# Altium schematic sheet Sheet2.SchDoc
size A4
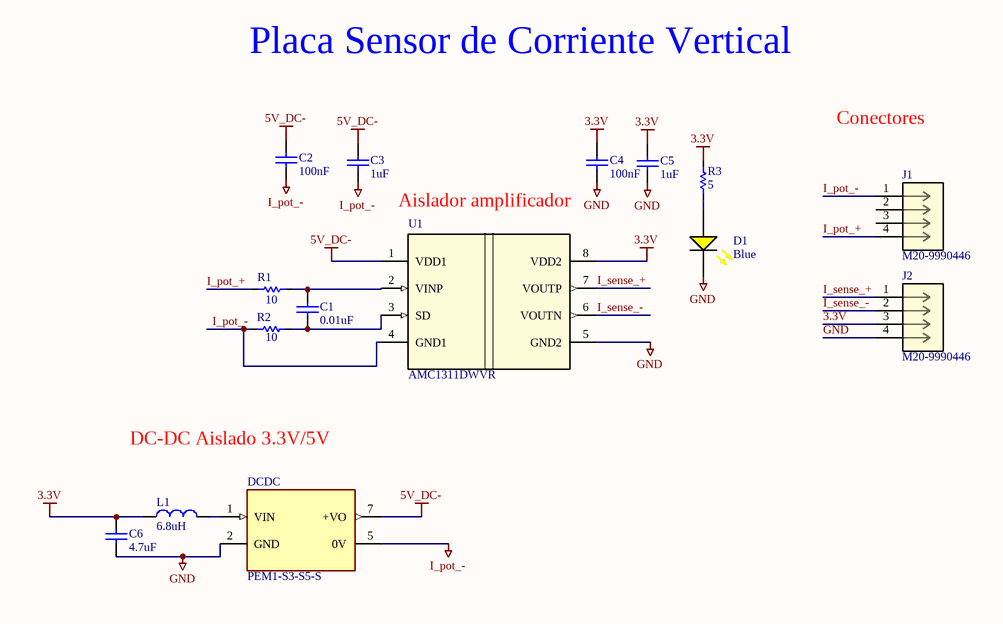
[diagram p0: Sheet2.SchDoc]

## Parts
C1  0.01uF  [CAP_0603]
C2  100nF  [CAP_0603]
C3  1uF  [CAP_0603]
C4  100nF  [CAP_0603]
C5  1uF  [CAP_0603]
C6  4.7uF  [CAP_0805]
D1  Blue  [LED_0603_Yellow]
DCDC  PEM1-S3-S5-S  [CONV_PEM1-S3-S5-S]
J1  M20-9990446  [CONN_M20_4_HRW]
J2  M20-9990446  [CONN_M20_4_HRW]
L1  6.8uH  [INDUCTOR_1210]
R1  10  [RES_0603]
R2  10  [RES_0603]
R3  5  [RES_0603]
U1  AMC1311DWVR  [DWV0008A]

## Nets
3.3V: C4.1 C5.1 C6.1 J2.3 L1.1 R3.2 U1.8(VDD2)
5V_DC-: C2.1 C3.1 DCDC.7(+VO) U1.1(VDD1)
GND: C4.2 C5.2 C6.2 D1.2(K) DCDC.2(GND) J2.4 U1.5(GND2)
I_pot_-: C2.2 C3.2 DCDC.5(0V) J1.1 R2.2 U1.4(GND1)
I_pot_+: J1.4 R1.2
I_sense_+: J2.1 U1.7(VOUTP)
I_sense_-: J2.2 U1.6(VOUTN)
NetC1_1: C1.1 R1.1 U1.2(VINP)
NetC1_2: C1.2 R2.1 U1.3(SD)
NetD1_1: D1.1(A) R3.1
NetDCDC_1: DCDC.1(VIN) L1.2

Not connected (* = marked no-connect by the designer): J1 2 3

## Notes on the sheet
- Placa Sensor de Corriente Vertical
- Conectores
- (near C4) Aislador amplificador
- DC-DC Aislado 3.3V/5V

## Library data of the parts
C1 C3 C5 = Cap_0603: 0.1µF ±10% 50V Ceramic Capacitor X7R 0603 (1608 Metric); MF: KEMET; MFP: C0603C104K5RACTU; Value: 100nF; Created: 2020_06_15_DAarancibia; Package: 0603; Supplier 1: Digi-Key; Supplier Part Number 1: 399-5089-1-ND
C2 C4 = Cap_0603: 0.1µF ±10% 50V Ceramic Capacitor X7R 0603 (1608 Metric); MF: KEMET; MFP: C0603C104K5RACTU; Created: 2020_06_15_DAarancibia; Package: 0603; Value: 100nF; Supplier 1: Digi-Key; Supplier Part Number 1: 399-5089-1-ND
C6 = Cap_0805: 0.1µF ±10% 50V Ceramic Capacitor X7R 0805 (2012 Metric); MF: KEMET; MFP: C0805C104K5RACTU; Value: 100nF; Created: 2020_06_15_DAarancibia; Package: 0805; Supplier 1: Digi-Key; Supplier Part Number 1: 399-1170-1-ND
D1 = Led_0603_Yellow: Yellow 590nm LED Indication - Discrete 2V 0603 (1608 Metric); MF: Würth Elektronik; MFP: 150060YS75000; Created: 2020_07_06_DAarancibia; Package: 0603; Value: Yellow; Supplier 1: Digi-Key; Supplier Part Number 1: 732-4981-1-ND
DCDC = PEM1-S3-S5-S: 12 Vdc, 0.083 A, 1 W, 10.8~13.2 Vdc Input Range; Package: None; Price: None; Value: *; MP: PEM1-S3-S5-S; Availability: Unavailable
J1 J2 = M20-9990446: No Description Available; Mfr_Name: Harwin; RefDes: RefDes; Type: Type
L1 = Inductor_1210: 10µH Unshielded Wirewound Inductor 700mA 350mOhm Max 1210 (3225 Metric); MF: Taiyo Yuden; MFP: BRL3225T100M; Value: 10uH; Created: 2020_07_06_DAarancibia; Package: 1210; Supplier 1: Digi-Key; Supplier Part Number 1: 587-5505-1-ND
R1-R3 = Res_0603: 10 kOhms ±1% 0.1W, 1/10W Chip Resistor 0402 (1005 Metric) Anti-Sulfur, Automotive AEC-Q200 Thick Film; MF: Panasonic Electronic Components; MFP: ERJ-3EKF1002V; Value: 10k; Created: 2020_06_15_DAarancibia; Package: 0603; Supplier 1: Digi-Key; Supplier Part Number 1: P10.0KHCT-ND
U1 = AMC1311DWVR: No Description Available; Mfr_Name: Texas Instruments; TYPE: TYPE; RefDes: RefDes